# EAGLE design ArduinoLEDs (EAGLE 5.06)
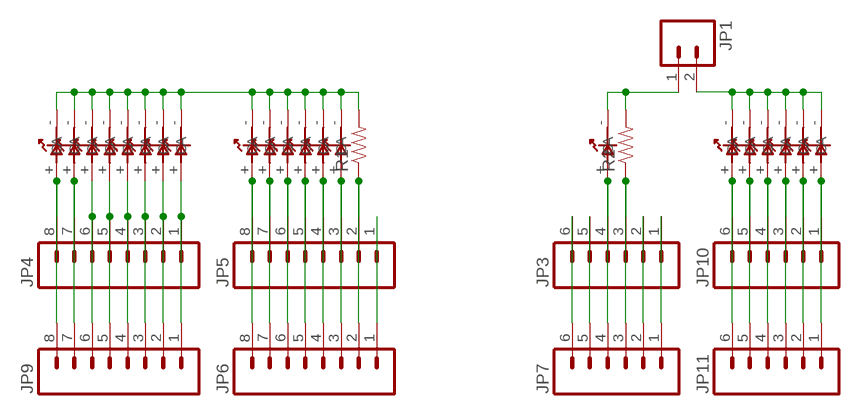
[diagram p0: schematic, sheet 1]

## Parts
JP1  M02LOCK  [1X02_LOCK]
JP3  M06LOCK  [1X06_LOCK]
JP4  M08LOCK  [1X08_LOCK]
JP5  M08LOCK  [1X08_LOCK]
JP6  M08LOCK  [1X08_LOCK]
JP7  M06LOCK  [1X06_LOCK]
JP9  M08LOCK  [1X08_LOCK]
JP10  M06LOCK  [1X06_LOCK]
JP11  M06LOCK  [1X06_LOCK]
R1  RESISTOR  [0805]
R2  RESISTOR  [0805]
U$1  LED0805  [0805-LED]
U$3  LED0805  [0805-LED]
U$4  LED0805  [0805-LED]
U$5  LED0805  [0805-LED]
U$6  LED0805  [0805-LED]
U$7  LED0805  [0805-LED]
U$8  LED0805  [0805-LED]
U$9  LED0805  [0805-LED]
U$10  LED0805  [0805-LED]
U$11  LED0805  [0805-LED]
U$12  LED0805  [0805-LED]
U$13  LED0805  [0805-LED]
U$14  LED0805  [0805-LED]
U$15  LED0805  [0805-LED]
U$16  LED0805  [0805-LED]
U$17  LED0805  [0805-LED]
U$18  LED0805  [0805-LED]
U$19  LED0805  [0805-LED]
U$20  LED0805  [0805-LED]
U$21  LED0805  [0805-LED]
U$22  LED0805  [0805-LED]

## Nets
N$1: JP5.2 JP6.2 R1.1
N$2: JP5.1 JP6.1
N$3: JP5.3 JP6.3 U$14.+(A)
N$4: JP5.4 JP6.4 U$13.+(A)
N$5: JP5.5 JP6.5 U$12.+(A)
N$6: JP5.6 JP6.6 U$11.+(A)
N$7: JP5.7 JP6.7 U$10.+(A)
N$8: JP5.8 JP6.8 U$9.+(A)
N$9: JP3.1 JP7.1
N$10: JP3.2 JP7.2
N$11: JP3.3 JP7.3 R2.1
N$12: JP3.4 JP7.4 U$1.+(A)
N$13: JP3.5 JP7.5
N$14: JP3.6 JP7.6
N$23: JP4.1 JP9.1 U$8.+(A)
N$24: JP4.2 JP9.2 U$7.+(A)
N$25: JP4.3 JP9.3 U$6.+(A)
N$26: JP4.4 JP9.4 U$5.+(A)
N$27: JP4.5 JP9.5 U$4.+(A)
N$28: JP4.6 JP9.6 U$3.+(A)
N$29: JP4.7 JP9.7 U$15.+(A)
N$30: JP4.8 JP9.8 U$16.+(A)
N$31: JP10.1 JP11.1 U$22.+(A)
N$32: JP10.2 JP11.2 U$21.+(A)
N$33: JP10.3 JP11.3 U$20.+(A)
N$34: JP10.4 JP11.4 U$19.+(A)
N$35: JP10.5 JP11.5 U$18.+(A)
N$36: JP10.6 JP11.6 U$17.+(A)
N$45: R1.2 U$3.-(C) U$4.-(C) U$5.-(C) U$6.-(C) U$7.-(C) U$8.-(C) U$9.-(C) U$10.-(C) U$11.-(C) U$12.-(C) U$13.-(C) U$14.-(C) U$15.-(C) U$16.-(C)
N$46: JP1.2 U$17.-(C) U$18.-(C) U$19.-(C) U$20.-(C) U$21.-(C) U$22.-(C)
N$47: JP1.1 R2.2 U$1.-(C)

## Library data of the parts
JP1 = 1dah:M02: Header 2 Standard 2-pin 0.1" header. Use with straight break away headers (SKU : PRT-00116), right angle break away headers (PRT-00553), swiss pins (PRT-00743), machine pins (PRT-00117), and female headers (PRT-00115). Molex polarized connector foot print use with SKU : PRT-08233 with associated crimp pins and housings.
JP3 JP7 JP10 JP11 = 1dah:M06: Header 6 Standard 6-pin 0.1" header. Use with straight break away headers (SKU : PRT-00116), right angle break away headers (PRT-00553), swiss pins (PRT-00743), machine pins (PRT-00117), and female headers (PRT-00115). Molex polarized connector foot print use with SKU : PRT-08094 with associated crimp pins and housings. NOTES ON THE VARIANTS LOCK and LOCK_LONGPADS... This footprint was designed to help hold the alignment of a through-hole component (i.e. 6-pin header) while soldering it into place. You may notice that each hole has been shifted either up or down by 0.005 of an inch from it's more standard position (which is a perfectly straight line). This slight alteration caused the pins (the squares in the middle) to touch the edges of the holes. Because they are alternating, it causes a "brace" to hold the component in place. 0.005 has proven to be the perfect amount of "off-center" position when using our standard breakaway headers. Although looks a little odd when you look at the bare footprint, once you have a header in there, the alteration is very hard to notice. Also, if you push a header all the way into place, it is covered up entirely on the bottom side. This idea of altering the position of holes to aid alignment will be further integrated into the Sparkfun Library for other footprints. It can help hold any component with 3 or more connection pins.
JP4-JP6 JP9 = 1dah:M08: Header 8 Standard 8-pin 0.1" header. Use with straight break away headers (SKU : PRT-00116), right angle break away headers (PRT-00553), swiss pins (PRT-00743), machine pins (PRT-00117), and female headers (PRT-00115).
R1 R2 = 1dah:RESISTOR: Resistor Basic schematic elements and footprints for 0603, 1206, and PTH 1/10th watt (small) resistors.
U$1 U$3-U$22 = 1dah:LED

## Board
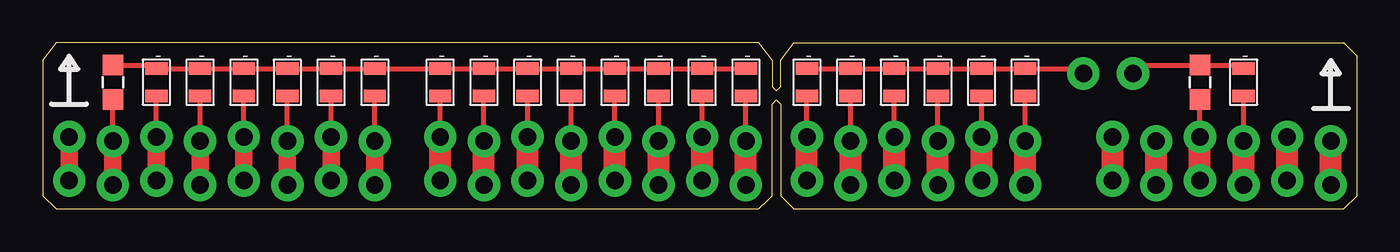
[diagram p1: board, top side]
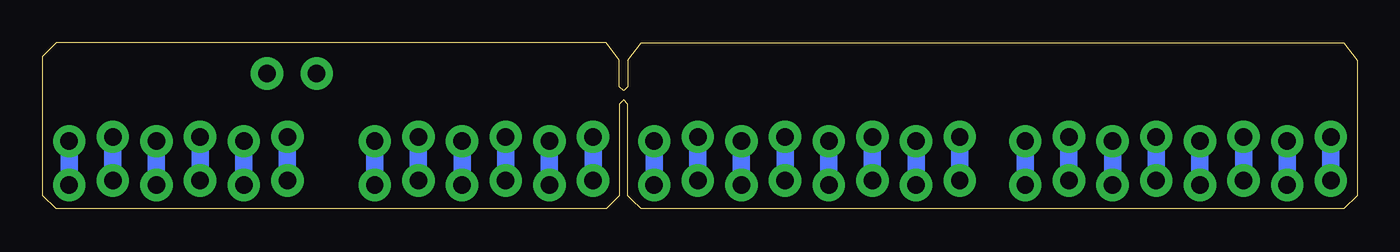
[diagram p2: board, bottom side, seen from below]

Size 76.45 x 9.65 mm. Coordinates in mm from the lower left corner, seen from the top.
Outline: 60.2,0 43.69,0 42.93,0.76 42.93,6.1 42.67,6.35 42.42,6.1 42.42,0.76 42.16,0.51 41.66,0 0.76,0 0,0.76 0,7.37 0,8.64 0.76,9.65 41.66,9.65 42.42,8.64 42.42,7.11 42.67,6.86 42.93,7.11 42.93,8.64 43.69,9.65 75.69,9.65 76.45,8.89 76.45,0.76 75.69,0 60.2,0
Outline: 59.94,0 60.2,0
Copper layers (1*16): Top 0.0356mm / dielectric 1.5011mm / Bottom 0.0356mm
Design rules "goldenpcb": minimum track width 9mil, minimum drill 18mil, track to track 9mil, track to pad 9mil, pad to pad 9mil, via to via 9mil, smd to smd 9mil, copper to edge 10mil, drill to drill 9mil, minimum pad ring 10mil, minimum via ring 8mil, stop-mask expansion 4mil, vias tented up to drill 25mil, thermal gap 10mil

### Footprints (pad centres in the part's own frame; a part is rotated, then mirrored left to right if it is on the bottom)
1X02_LOCK = drill 1.016 pad 1.88 round: 1 -0.178,0; 2 2.718,0
1X06_LOCK = drill 1.016 pad 1.88 round: 1 0,0.127; 2 2.54,-0.127; 3 5.08,0.127; 4 7.62,-0.127; 5 10.16,0.127; 6 12.7,-0.127
1X08_LOCK = drill 1.016 pad 1.88 round: 1 0,0.127; 2 2.54,-0.127; 3 5.08,0.127; 4 7.62,-0.127; 5 10.16,0.127; 6 12.7,-0.127; 7 15.24,0.127; 8 17.78,-0.127
0805 = smd 1.2 x 1.2: 1 -1,0; 2 1,0
0805-LED = smd 1.3 x 0.7: + 0,0.8; - 0,-0.8

### Placement (x,y rotation side)
JP1  63.25,7.87 180 top
JP3  62.23,4.06 0 top
JP4  23.11,4.06 0 top
JP5  1.52,4.06 0 top
JP6  1.52,1.52 0 top
JP7  62.23,1.52 0 top
JP9  23.11,1.52 0 top
JP10  44.45,4.06 0 top
JP11  44.45,1.52 0 top
R1  4.06,7.37 90 top
R2  67.31,7.37 90 top
U$1  69.85,7.37 180 top
U$3  35.81,7.37 180 top
U$4  33.27,7.37 180 top
U$5  30.73,7.37 180 top
U$6  28.19,7.37 180 top
U$7  25.65,7.37 180 top
U$8  23.11,7.37 180 top
U$9  19.3,7.37 180 top
U$10  16.76,7.37 180 top
U$11  14.22,7.37 180 top
U$12  11.68,7.37 180 top
U$13  9.14,7.37 180 top
U$14  6.6,7.37 180 top
U$15  38.35,7.37 180 top
U$16  40.89,7.37 180 top
U$17  57.15,7.37 180 top
U$18  54.61,7.37 180 top
U$19  52.07,7.37 180 top
U$20  49.53,7.37 180 top
U$21  46.99,7.37 180 top
U$22  44.45,7.37 180 top

### Tracks (layer width: path | path; a pad name or v marks a point on that pad's centre or on a via)
N$1
  Top 0.305: JP5.2 R1.1
  Top 1.016: JP6.2 JP5.2
N$2
  Top 1.016: JP6.1 JP5.1
N$3
  Top 0.305: JP5.3 U$14.+
  Top 1.016: JP6.3 JP5.3
N$4
  Top 0.305: JP5.4 U$13.+
  Top 1.016: JP6.4 JP5.4
N$5
  Top 0.305: JP5.5 U$12.+
  Top 1.016: JP6.5 JP5.5
N$6
  Top 0.305: JP5.6 U$11.+
  Top 1.016: JP6.6 JP5.6
N$7
  Top 0.305: JP5.7 U$10.+
  Top 1.016: JP6.7 JP5.7
N$8
  Top 0.305: JP5.8 U$9.+
  Top 1.016: JP6.8 JP5.8
N$9
  Top 1.27: JP7.1 JP3.1
N$10
  Top 1.27: JP7.2 JP3.2
N$11
  Top 0.305: JP3.3 R2.1
  Top 1.27: JP7.3 JP3.3
N$12
  Top 0.305: JP3.4 U$1.+
  Top 1.27: JP7.4 JP3.4
N$13
  Top 1.27: JP7.5 JP3.5
N$14
  Top 1.27: JP7.6 JP3.6
N$15
  Bottom 1.016: 1.52,1.52 1.52,4.32
N$16
  Bottom 1.016: 4.06,1.52 4.06,4.06
N$17
  Bottom 1.016: 6.6,1.52 6.6,4.06
N$18
  Bottom 1.016: 9.14,1.52 9.14,4.06
N$19
  Bottom 1.016: 11.68,1.52 11.68,4.06
N$20
  Bottom 1.016: 14.22,1.52 14.22,4.06
N$21
  Bottom 1.016: 16.76,1.52 16.76,4.32
N$22
  Bottom 1.016: 19.3,1.02 19.3,4.06
N$23
  Top 0.305: JP4.1 U$8.+
  Top 1.27: JP9.1 JP4.1
N$24
  Top 0.305: JP4.2 U$7.+
  Top 1.27: JP9.2 JP4.2
N$25
  Top 0.305: JP9.3 U$6.+
  Top 1.27: JP9.3 JP4.3
N$26
  Top 0.305: JP4.4 U$5.+
  Top 1.27: JP9.4 JP4.4
N$27
  Top 0.305: JP9.5 U$4.+
  Top 1.27: JP9.5 JP4.5
N$28
  Top 0.305: JP4.6 U$3.+
  Top 1.27: JP9.6 JP4.6
N$29
  Top 0.305: JP4.7 U$15.+
  Top 1.27: JP9.7 JP4.7
N$30
  Top 0.305: JP4.8 U$16.+
  Top 1.27: JP9.8 JP4.8
N$31
  Top 0.305: JP10.1 U$22.+
  Top 1.27: JP11.1 JP10.1
N$32
  Top 0.305: JP10.2 U$21.+
  Top 1.27: JP11.2 JP10.2
N$33
  Top 0.305: JP10.3 U$20.+
  Top 1.27: JP11.3 JP10.3
N$34
  Top 0.305: JP10.4 U$19.+
  Top 1.27: JP11.4 JP10.4
N$35
  Top 0.305: JP10.5 U$18.+
  Top 1.27: JP11.5 JP10.5
N$36
  Top 0.305: JP10.6 U$17.+
  Top 1.27: JP11.6 JP10.6
N$37
  Bottom 1.016: 23.11,1.52 23.11,4.32
N$38
  Bottom 1.016: 25.65,1.27 25.65,4.06
N$39
  Bottom 1.016: 28.19,1.52 28.19,4.32
N$40
  Bottom 1.016: 30.73,1.27 30.73,4.06
N$41
  Bottom 1.016: 33.27,1.52 33.27,4.32
N$42
  Bottom 1.016: 35.81,1.27 35.81,4.06
N$43
  Bottom 1.016: 38.35,1.27 38.35,4.32
N$44
  Bottom 1.016: 40.89,1.27 40.89,4.06
N$45
  Top 0.305: R1.2 6.6,8.37 U$14.- U$13.- U$12.- U$11.- U$10.- U$9.- U$8.- U$7.- U$6.- U$5.- U$4.- U$3.- U$15.- U$16.-
N$46
  Top 0.305: U$22.- U$21.- U$20.- U$19.- U$18.- U$17.- 60.53,8.17 JP1.2
N$47
  Top 0.305: JP1.1 63.42,8.37 R2.2 69.85,8.37 U$1.-
N$48
  Bottom 1.016: 44.45,1.52 44.45,4.32
N$49
  Bottom 1.016: 46.99,1.27 46.99,4.06
N$50
  Bottom 1.016: 49.53,1.52 49.53,4.57
N$51
  Bottom 1.016: 52.07,1.27 52.07,4.06
N$52
  Bottom 1.016: 54.61,1.52 54.61,4.32
N$53
  Bottom 1.016: 57.15,1.27 57.15,4.06
N$54
  Bottom 1.016: 62.23,1.52 62.23,4.32
N$55
  Bottom 1.016: 64.77,1.27 64.77,4.06
N$56
  Bottom 1.016: 67.31,1.52 67.31,4.32
N$57
  Bottom 1.016: 69.85,1.27 69.85,4.06
N$58
  Bottom 1.016: 72.39,1.52 72.39,4.32
N$59
  Bottom 1.016: 74.93,1.27 74.93,4.06